# Altium schematic sheet pioneer_2-bluepill_eletronic_wrapper-communication.SchDoc
size A; SheetNumber: 3; SheetTotal: 3
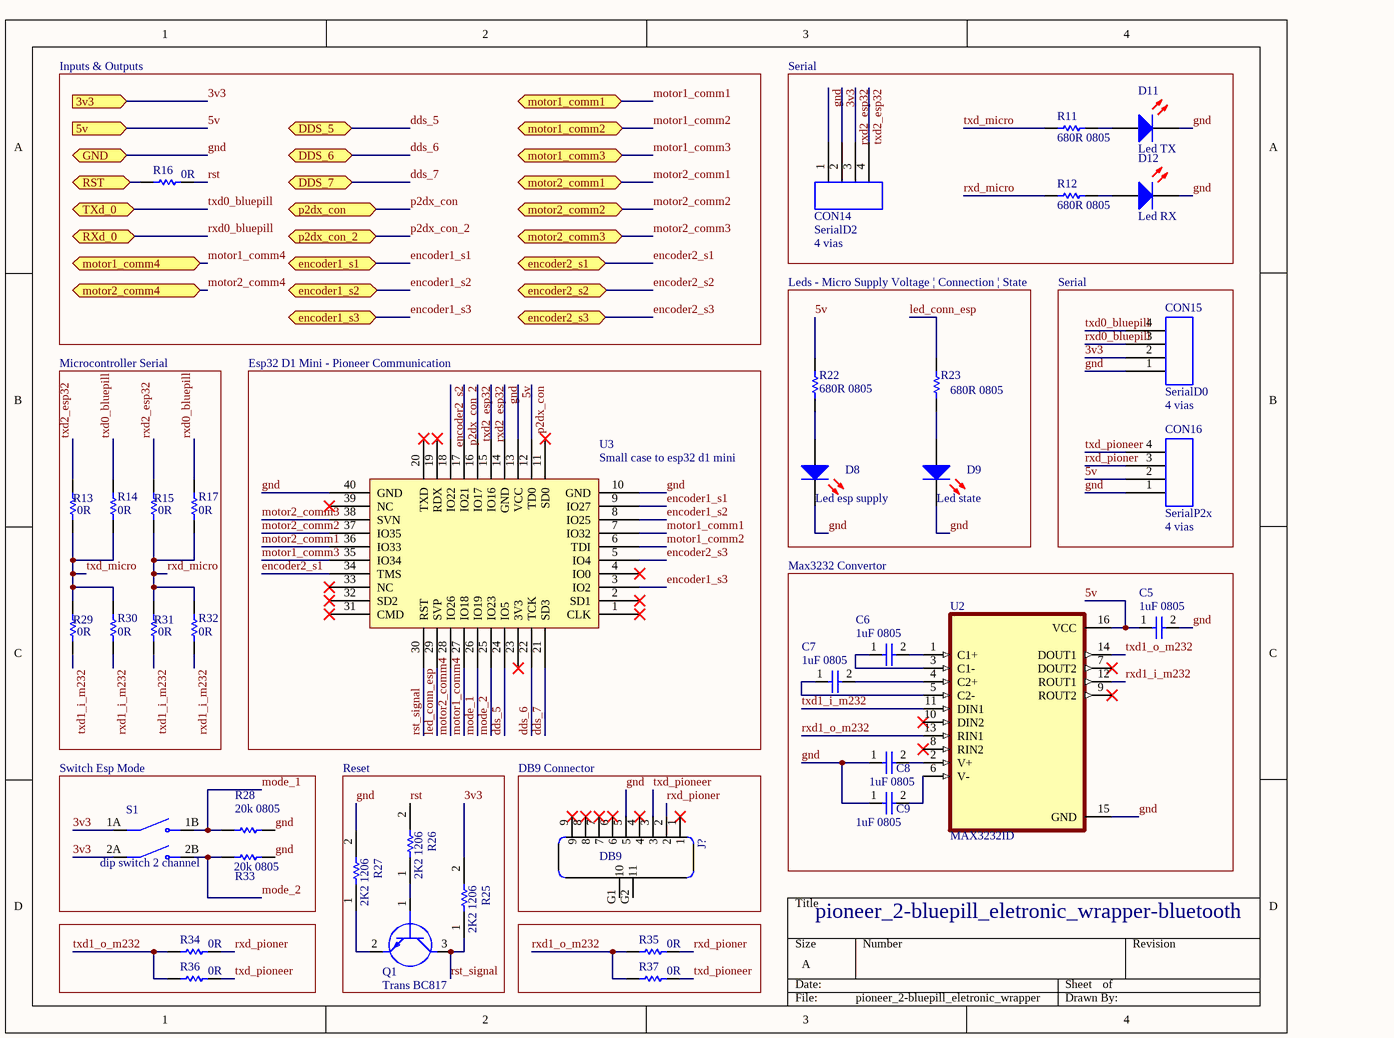
[diagram p0: pioneer_2-bluepill_eletronic_wrapper-communication.SchDoc]

## Parts
C5  1uF 0805  [CAPACITOR 0805]
C6  1uF 0805  [CAPACITOR 0805]
C7  1uF 0805  [CAPACITOR 0805]
C8  1uF 0805  [CAPACITOR 0805]
C9  1uF 0805  [CAPACITOR 0805]
CON14  SerialD2  Valor: 4 vias  [4vias]
CON15  SerialD0  Valor: 4 vias  [4vias]
CON16  SerialP2x  Valor: 4 vias  [4vias]
D8  Led esp supply  [LED RED]
D9  Led state  [LED RED]
D11  Led TX  [LED RED]
D12  Led RX  [LED RED]
J?  DB9  [*DB9_DB9(Primary)]
Q1  Trans BC817  [SOT96P240X110-3N]
R11  680R 0805  [RESISTOR 0805]
R12  680R 0805  [RESISTOR 0805]
R13  0R  [RESISTOR 0603]
R14  0R  [RESISTOR 0603]
R15  0R  [RESISTOR 0603]
R16  0R  [RESISTOR 0603]
R17  0R  [RESISTOR 0603]
R22  680R 0805  [RESISTOR 0805]
R23  680R 0805  [RESISTOR 0805]
R25  2K2 1206  [RESC3216X60N]
R26  2K2 1206  [RESC3216X60N]
R27  2K2 1206  [RESC3216X60N]
R28  20k 0805  [RESISTOR 0805]
R29  0R  [RESISTOR 0603]
R30  0R  [RESISTOR 0603]
R31  0R  [RESISTOR 0603]
R32  0R  [RESISTOR 0603]
R33  20k 0805  [RESISTOR 0805]
R34  0R  [RESISTOR 0603]
R35  0R  [RESISTOR 0603]
R36  0R  [RESISTOR 0603]
R37  0R  [RESISTOR 0603]
S1  dip switch 2 channel  [SW_DS02-254-2L-02BE]
U2  MAX3232ID  [SOIC127P600X175-16N]
U3  Small case to esp32 d1 mini  [ESP32 D1 MINI]

## Blocks framed on the sheet
Inputs & Outputs: R16
Serial: CON14 D11 D12 R11 R12
Leds - Micro Supply Voltage | Connection | State: D8 D9 R22 R23
Serial: CON15 CON16
Microcontroller Serial: R13-R15 R17 R29-R32
Esp32 D1 Mini - Pioneer Communication: U3
Max3232 Convertor: C5-C9 U2
Switch Esp Mode: R28 R33 S1
Reset: Q1 R25-R27
DB9 Connector: J?

## Ports
3v3 (in, see pioneer_2-bluepill_eletronic_wrapper[3B], pioneer_2-bluepill_eletronic_wrapper-supply[1A]), 5v (in, see pioneer_2-bluepill_eletronic_wrapper[3B], pioneer_2-bluepill_eletronic_wrapper-supply[1A]), DDS_5 (bidir, see pioneer_2-bluepill_eletronic_wrapper[3B]), DDS_6 (bidir, see pioneer_2-bluepill_eletronic_wrapper[3B]), DDS_7 (bidir, see pioneer_2-bluepill_eletronic_wrapper[3B]), encoder1_s1 (bidir, see pioneer_2-bluepill_eletronic_wrapper[3B]), encoder1_s2 (bidir, see pioneer_2-bluepill_eletronic_wrapper[3C]), encoder1_s3 (bidir, see pioneer_2-bluepill_eletronic_wrapper[3C]), encoder2_s1 (bidir, see pioneer_2-bluepill_eletronic_wrapper[3C]), encoder2_s2 (bidir, see pioneer_2-bluepill_eletronic_wrapper[3C]), encoder2_s3 (bidir, see pioneer_2-bluepill_eletronic_wrapper[3C]), GND (bidir, see pioneer_2-bluepill_eletronic_wrapper[3B], pioneer_2-bluepill_eletronic_wrapper-supply[1A]), motor1_comm1 (bidir, see pioneer_2-bluepill_eletronic_wrapper[3B]), motor1_comm2 (bidir, see pioneer_2-bluepill_eletronic_wrapper[3B]), motor1_comm3 (bidir, see pioneer_2-bluepill_eletronic_wrapper[3B]), motor1_comm4 (bidir, see pioneer_2-bluepill_eletronic_wrapper[3B]), motor2_comm1 (bidir, see pioneer_2-bluepill_eletronic_wrapper[3B]), motor2_comm2 (bidir, see pioneer_2-bluepill_eletronic_wrapper[3B]), motor2_comm3 (bidir, see pioneer_2-bluepill_eletronic_wrapper[3B]), motor2_comm4 (bidir, see pioneer_2-bluepill_eletronic_wrapper[3B]), p2dx_con (bidir, see pioneer_2-bluepill_eletronic_wrapper[3C]), p2dx_con_2 (bidir, see pioneer_2-bluepill_eletronic_wrapper[3C]), RST (bidir, see pioneer_2-bluepill_eletronic_wrapper[3B]), RXd_0 (bidir, see pioneer_2-bluepill_eletronic_wrapper[3B]), TXd_0 (bidir, see pioneer_2-bluepill_eletronic_wrapper[3B])

## Nets
3v3: CON14.2 CON15.2 R25.2 S1.1A(COM1) S1.2A(COM2) ; port 3v3
5v: C5.1 CON16.2 R22.2 U2.16(VCC) U3.13(VCC) ; port 5v
dds_5: U3.24(IO5) ; port DDS_5
dds_6: U3.22(TCK) ; port DDS_6
dds_7: U3.21(SD3) ; port DDS_7
encoder1_s1: U3.9(IO27) ; port encoder1_s1
encoder1_s2: U3.8(IO25) ; port encoder1_s2
encoder1_s3: U3.3(IO2) ; port encoder1_s3
encoder2_s1: U3.34(TMS) ; port encoder2_s1
encoder2_s2: U3.18(IO22) ; port encoder2_s2
encoder2_s3: U3.5(IO4) ; port encoder2_s3
gnd: C5.2 C8.1 C9.1 CON14.1 CON15.1 CON16.1 D8.2(K) D9.2(K) D11.2(K) D12.2(K) J?.5 R27.2 R28.1 R33.2 U2.15(GND) U3.10(GND) U3.14(GND) U3.40(GND) ; port GND
led_conn_esp: R23.2 U3.29(SVP)
mode_1: R28.2 S1.1B(NO1) U3.26(IO19)
mode_2: R33.1 S1.2B(NO2) U3.25(IO23)
motor1_comm1: U3.7(IO32) ; port motor1_comm1
motor1_comm2: U3.6(TDI) ; port motor1_comm2
motor1_comm3: U3.35(IO34) ; port motor1_comm3
motor1_comm4: U3.27(IO18) ; port motor1_comm4
motor2_comm1: U3.36(IO33) ; port motor2_comm1
motor2_comm2: U3.37(IO35) ; port motor2_comm2
motor2_comm3: U3.38(SVN) ; port motor2_comm3
motor2_comm4: U3.28(IO26) ; port motor2_comm4
p2dx_con: U3.12(TD0) ; port p2dx_con
p2dx_con_2: U3.17(IO21) ; port p2dx_con_2
rst: R16.2 R26.2
RST: R16.1 ; port RST  [a separate net that carries the same name]
rst_signal: Q1.3(C) R25.1 U3.30(RST)
rxd0_bluepill: CON15.3 R17.2 ; port RXd_0
rxd1_i_m232: R30.1 R32.1 U2.12(ROUT1)
rxd1_o_m232: R35.2 R37.2 U2.13(RIN1)
rxd2_esp32: CON14.3 R15.2 U3.15(IO16)
rxd_micro: R12.2 R15.1 R17.1 R31.2 R32.2
rxd_pioner: CON16.3 J?.2 R34.1 R35.1
txd0_bluepill: CON15.4 R14.2 ; port TXd_0
txd1_i_m232: R29.1 R31.1 U2.11(DIN1)
txd1_o_m232: R34.2 R36.2 U2.14(DOUT1)
txd2_esp32: CON14.4 R13.2 U3.16(IO17)
txd_micro: R11.2 R13.1 R14.1 R29.2 R30.2
txd_pioneer: CON16.4 J?.3 R36.1 R37.1
NetC6_1: C6.1 U2.3(C1-)
NetC6_2: C6.2 U2.1(C1+)
NetC7_1: C7.1 U2.5(C2-)
NetC7_2: C7.2 U2.4(C2+)
NetC8_2: C8.2 U2.2(V+)
NetC9_2: C9.2 U2.6(V-)
NetD8_1: D8.1(A) R22.1
NetD9_1: D9.1(A) R23.1
NetD11_1: D11.1(A) R11.1
NetD12_1: D12.1(A) R12.1
NetQ1_1: Q1.1(B) R26.1
NetQ1_2: Q1.2(E) R27.1

Not connected (* = marked no-connect by the designer): J? 1* 4* 6* 7* 8* 9* G1(10) G2(11); U2 7(DOUT2)* 8(RIN2)* 9(ROUT2)* 10(DIN2)*; U3 1(CLK)* 2(SD1)* 4(IO0)* 11(SD0)* 19(RDX)* 20(TXD)* 23(3V3)* 31(CMD)* 32(SD2)* 33(NC)* 39(NC)*

## Notes on the sheet
- pioneer_2-bluepill_eletronic_wrapper-bluetooth

## Library data of the parts
C5-C9 = CAP 0805: capacitor 0805; Manufacturer: PANASONIC ELECTRONIC COMPONENTS; Manufacturer Part Number: ERJ-3GEY0R00V; Product Range: AEC-Q200 ERJ3; Resistance: 0; Power Rating: 100; Voltage Rating: 75; Resistor Case Style: 0603 [1608 Metric]; Resistance (Ohms): 0.0; Tolerance: Jumper; Power (Watts): 0.1W, 1/10W; Type: Thick Film Resistors SMD; Brand: Panasonic; Qualification: AEC-Q200; RoHS: YES; Resistance Tolerance: -; Packaging: Cut Tape; MSL: -; ComponentLink1URL: http://www.farnell.com/cad/1697908.zip; ComponentLink1Description: http://www.farnell.com/cad/1697908.zip; ComponentLink2URL: http://www.farnell.com/datasheets/1678796.pdf; ComponentLink2Description: http://www.farnell.com/datasheets/1678796.pdf; Category: Resistors; Composition: Thick Film; Features: Automotive AEC-Q200; Temperature Coefficient: -; Operating Temperature: -55°C ~ 155°C; Package / Case: 0603 (1608 Metric); Supplier Device Package: 0603; Size / Dimension: 0.063" L x 0.031" W (1.60mm x 0.80mm); Height: 0.022" (0.55mm); Number of Terminations: 2; ComponentLink3URL: http://industrial.panasonic.com/www-cgi/jvcr13pz.cgi?E+PZ+3+AOA0001+ERJ3GEY0R00V+7+WW; ComponentLink3Description: http://industrial.panasonic.com/www-cgi/jvcr13pz.cgi?E+PZ+3+AOA0001+ERJ3GEY0R00V+7+WW; Supplier 1: Mouser; Stock 1: 1987085; Pricing 1: 1=0.160, 10=0.019, 100=0.013, 500=0.010, 1000=0.005, 5000=0.003 (AUD); Length: 1.6 mm; Operating Temperature Range: - 55 C to + 155 C; Product: Thick Film Resistors Zero-Ohm; Series: ERJ; Termination Style: SMD/SMT; Width: 0.8 mm; Case Code - in: 0603; Case Code - mm: 1608; RoHS - Mouser: E; Minimum Order Quantity: 1; Reeling: True; ComponentLink4URL: http://www.mouser.com/ds/2/315/AOA0000C84-947596.pdf; ComponentLink4Description: http://www.mouser.com/ds/2/315/AOA0000C84-947596.pdf; Supplier Part Number 1: 667-ERJ-3GEY0R00V
CON14-CON16 = 2.54_4vias: holes 2.54mm 4 vias; Descrição: Conector KK 3 vias com passo 2.54mm; Encapsulamento: PTH - 180º; Modelo: 3 vias - 180º; Marca: *; Observação: *
D8 D9 D11 D12 = LED 3MM RED: Manufacturer: Paralight; Manufacturer Part Number: IMP585; Wavelength Typ: 625; Forward Voltage: 2; Forward Current If: 20; Luminous Intensity: 3; LED Mounting: Through Hole; Lens Shape: Round; Viewing Angle: 60°; SVHC: No SVHC (15-Jun-2015); External Diameter: 2.9; External Length / Height: 4.6; Forward Voltage VF Max: 2.5; LED / Lamp Size: 3mm / T-1; LED Type: Standard; Lead Cross-section Depth: 0.5; Luminous Intensity @ If Min: 0.7; PIV Max: 5; Peak Forward Current: 7; Voltage Vf Typ: 2.2V<!--FANDB--><div class="features-and-benefits-container"><div class="features-and-benefits-description"><span class="features-benefits-value">The L-934LID from Kingbright is a through hole round shape high efficiency red colour LED. The device is made of gallium arsenide phosphide on gallium phosphide orange light emitting diode. This LED is widely used because of low power consumption, long life and solid state reliability.</span></div><div class="features-and-benefits-list"><ul class="features-and-benefits-list-list"><li class="features-and-benefits-list-item">Standard bulb size of T-1 (3mm)</li><li class="features-and-benefits-list-item">Reliable and rugged</li><li class="features-and-benefits-list-item">Viewing angle is 60°</li><li class="features-and-benefits-list-item">Luminous intensity of 3mcd at 2mA</li><li class="features-and-benefits-list-item">Forward voltage is 2.0V</li><li class="features-and-benefits-list-item">Forward current (If) is 20mA</li><li class="features-and-benefits-list-item">Dominant wavelength is 625nm at IF=20mA</li><li class="features-and-benefits-list-item">Peak wavelength is 627nm at IF=20; Supplier 1: Mult Comercial; RoHS: YES; Stock 1: 35260; Pricing 1: 1=0.15 (BRL); LED Colour: Red; Bulb Size: 3mm; Packaging: Each; MSL: -; Current If Luminous Intensity: 2; Dominant Wavelength: 625; Forward Current If Max: 20; Lead Cross-section Width: 0.5; Lead Spacing: 2.54; Luminous Intensity Typ: 3; Mounting Type: PCB Through Hole; No. of Pins: 2; Operating Temperature Max: 85; Operating Temperature Min: -40; Operating Temperature Range: -40°C to +85; Peak Wavelength: 625; ComponentLink1URL: http://loja.multcomercial.com.br/led-3mm-vermelho-difuso-l-314hd-paralight.html; ComponentLink1Description: http://loja.multcomercial.com.br/led-3mm-vermelho-difuso-l-314hd-paralight.html; Supplier Part Number 1: Led 3mm Vermelho Difuso L-314HD - Paralight
J? = DB9: Cable Grip 0.38 ~ 0.50 (9.5mm ~ 12.7mm) Aluminum - Silver; MF: Amphenol; MP: DB-9; SnapEDA_Link: https://www.snapeda.com/parts/DB-9/Amphenol/view-part/?ref=snap; Package: None; Check_prices: https://www.snapeda.com/parts/DB-9/Amphenol/view-part/?ref=eda; Value: *
Q1 = Trans BC817: Transistor BJT NPN BC817-25-7-F; Manufacturer_Name: Diodes Inc.; Datasheet Link: https://www.diodes.com/assets/Datasheets/ds11107.pdf; Height: 1.1mm; Manufacturer_Part_Number: BC817-25-7-F; Mouser Part Number: 621-BC817-25-7-F; Mouser Price/Stock: https://www.mouser.co.uk/ProductDetail/Diodes-Incorporated/BC817-25-7-F?qs=rGAXPo9uwV0jK0EyLZnqOw%3D%3D; Arrow Part Number: BC817-25-7-F; Arrow Price/Stock: https://www.arrow.com/en/products/bc817-25-7-f/diodes-incorporated
R11 R12 R22 R23 R28 R33 = RES 0805 5%: 0805; Manufacturer: PANASONIC ELECTRONIC COMPONENTS; Manufacturer Part Number: ERJ-3GEY0R00V; Product Range: AEC-Q200 ERJ3; Resistance: 0; Power Rating: 100; Voltage Rating: 75; Resistor Case Style: 0603 [1608 Metric]; Resistance (Ohms): 0.0; Tolerance: Jumper; Power (Watts): 0.1W, 1/10W; Brand: Panasonic; Qualification: AEC-Q200; RoHS: YES; Resistance Tolerance: -; Packaging: Cut Tape; MSL: -; ComponentLink1URL: http://www.farnell.com/cad/1697908.zip; ComponentLink1Description: http://www.farnell.com/cad/1697908.zip; ComponentLink2URL: http://www.farnell.com/datasheets/1678796.pdf; ComponentLink2Description: http://www.farnell.com/datasheets/1678796.pdf; Category: Resistors; Composition: Thick Film; Features: Automotive AEC-Q200; Temperature Coefficient: -; Operating Temperature: -55°C ~ 155°C; Package / Case: 0603 (1608 Metric); Supplier Device Package: 0603; Size / Dimension: 0.063" L x 0.031" W (1.60mm x 0.80mm); Height: 0.022" (0.55mm); Number of Terminations: 2; ComponentLink3URL: http://industrial.panasonic.com/www-cgi/jvcr13pz.cgi?E+PZ+3+AOA0001+ERJ3GEY0R00V+7+WW; ComponentLink3Description: http://industrial.panasonic.com/www-cgi/jvcr13pz.cgi?E+PZ+3+AOA0001+ERJ3GEY0R00V+7+WW; Supplier 1: Mouser; Stock 1: 1987085; Pricing 1: 1=0.160, 10=0.019, 100=0.013, 500=0.010, 1000=0.005, 5000=0.003 (AUD); Length: 1.6 mm; Operating Temperature Range: - 55 C to + 155 C; Product: Thick Film Resistors Zero-Ohm; Series: ERJ; Termination Style: SMD/SMT; Type: Thick Film Resistors SMD; Width: 0.8 mm; Case Code - in: 0603; Case Code - mm: 1608; RoHS - Mouser: E; Minimum Order Quantity: 1; Reeling: True; ComponentLink4URL: http://www.mouser.com/ds/2/315/AOA0000C84-947596.pdf; ComponentLink4Description: http://www.mouser.com/ds/2/315/AOA0000C84-947596.pdf; Supplier Part Number 1: 667-ERJ-3GEY0R00V
R13-R17 R29-R32 R34-R37 = RES 0603 5%: 0603; Manufacturer: PANASONIC ELECTRONIC COMPONENTS; Manufacturer Part Number: ERJ-3GEY0R00V; Product Range: AEC-Q200 ERJ3; Resistance: 0; Power Rating: 100; Voltage Rating: 75; Resistor Case Style: 0603 [1608 Metric]; Resistance (Ohms): 0.0; Tolerance: Jumper; Power (Watts): 0.1W, 1/10W; Brand: Panasonic; Qualification: AEC-Q200; RoHS: YES; Resistance Tolerance: -; Packaging: Cut Tape; MSL: -; ComponentLink1URL: http://www.farnell.com/cad/1697908.zip; ComponentLink1Description: http://www.farnell.com/cad/1697908.zip; ComponentLink2URL: http://www.farnell.com/datasheets/1678796.pdf; ComponentLink2Description: http://www.farnell.com/datasheets/1678796.pdf; Category: Resistors; Composition: Thick Film; Features: Automotive AEC-Q200; Temperature Coefficient: -; Operating Temperature: -55°C ~ 155°C; Package / Case: 0603 (1608 Metric); Supplier Device Package: 0603; Size / Dimension: 0.063" L x 0.031" W (1.60mm x 0.80mm); Height: 0.022" (0.55mm); Number of Terminations: 2; ComponentLink3URL: http://industrial.panasonic.com/www-cgi/jvcr13pz.cgi?E+PZ+3+AOA0001+ERJ3GEY0R00V+7+WW; ComponentLink3Description: http://industrial.panasonic.com/www-cgi/jvcr13pz.cgi?E+PZ+3+AOA0001+ERJ3GEY0R00V+7+WW; Supplier 1: Mouser; Stock 1: 1987085; Pricing 1: 1=0.160, 10=0.019, 100=0.013, 500=0.010, 1000=0.005, 5000=0.003 (AUD); Length: 1.6 mm; Operating Temperature Range: - 55 C to + 155 C; Product: Thick Film Resistors Zero-Ohm; Series: ERJ; Termination Style: SMD/SMT; Type: Thick Film Resistors SMD; Width: 0.8 mm; Case Code - in: 0603; Case Code - mm: 1608; RoHS - Mouser: E; Minimum Order Quantity: 1; Reeling: True; ComponentLink4URL: http://www.mouser.com/ds/2/315/AOA0000C84-947596.pdf; ComponentLink4Description: http://www.mouser.com/ds/2/315/AOA0000C84-947596.pdf; Supplier Part Number 1: 667-ERJ-3GEY0R00V
R25-R27 = RES 1206: RES 1206 5%; Manufacturer_Name: Vishay; Manufacturer_Part_Number: CRCW12064K70FKEA; Datasheet Link: http://docs-emea.rs-online.com/webdocs/13ec/0900766b813ecc08.pdf; Height: 0.6mm; Mouser Part Number: 71-CRCW1206-4.7K-E3; Mouser Price/Stock: https://www.mouser.co.uk/ProductDetail/Vishay-Dale/CRCW12064K70FKEA?qs=1vm4qhDHCvlKJmatsKzyFQ%3D%3D; Arrow Part Number: CRCW12064K70FKEA; Arrow Price/Stock: https://www.arrow.com/en/products/crcw12064k70fkea/vishay
S1 = dip switch 2 channel: DS02-254-2L-02BE; Price: None; MP: DS02-254-2L-02BE; Availability: Unavailable; Value: *; Package: None
U2 = MAX3232ID: 3-V to 5.5-V multichannel RS-232 line driver & receiver 16-SOIC -40 to 85; MF: Texas Instruments; Price: None; Value: *; Package: SOIC-16 Texas Instruments; Mouser-Purchase-URL: https://snapeda.com/shop?store=Mouser&id=215166; SnapEDA_Link: https://www.snapeda.com/parts/MAX3232ID/Texas%20Instruments/view-part/215166/?ref=snap; DigiKey-Purchase-URL: https://snapeda.com/shop?store=DigiKey&id=215166; MP: MAX3232ID; Texas_Instruments-Purchase-URL: https://snapeda.com/shop?store=Texas+Instruments&id=215166; Availability: Good
U3 = ESP32 D1 Mini